# EAGLE design untitled (EAGLE 7.7.0)
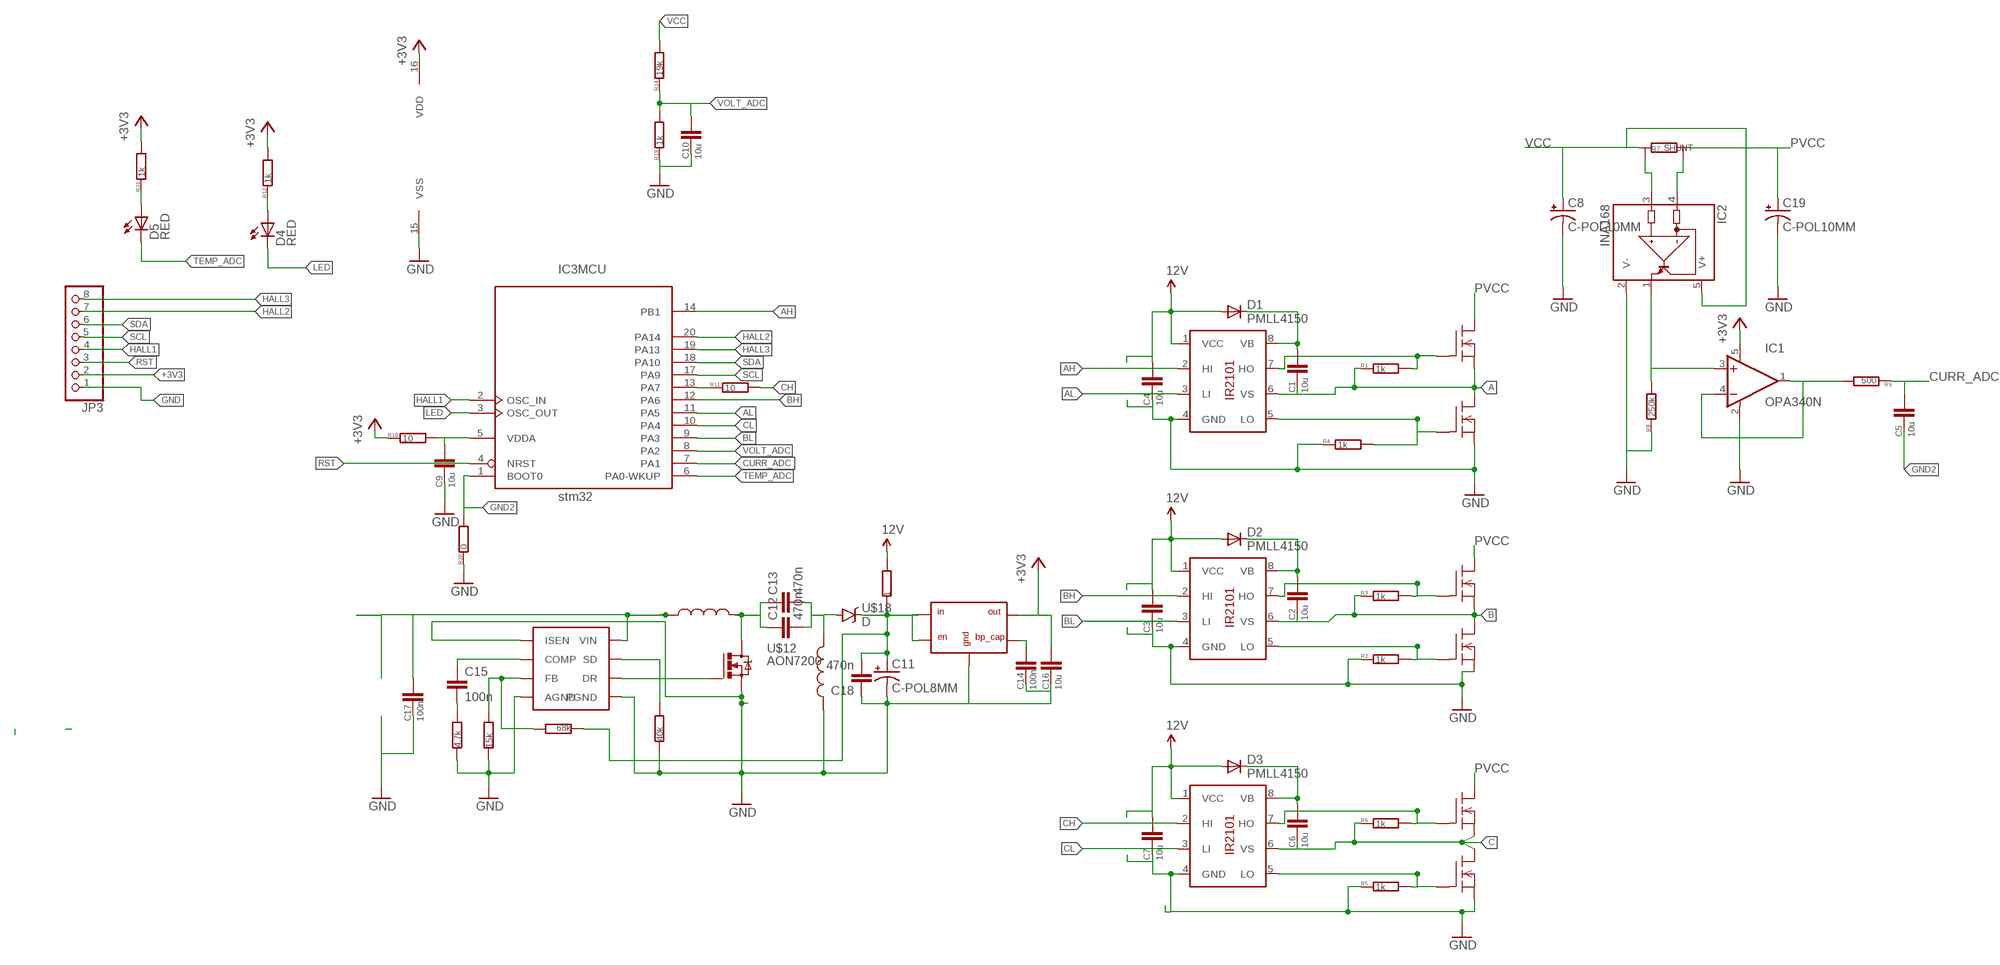
[diagram p0: schematic, sheet 1]

## Parts
C1  10u  CC0805  [C0805]
C2  10u  CC0805  [C0805]
C3  10u  CC0805  [C0805]
C4  10u  CC0805  [C0805]
C5  10u  CC0603  [C0603]
C6  10u  CC0805  [C0805]
C7  10u  CC0805  [C0805]
C8  C-POL10MM  [PCAP10]
C9  10u  CC0805  [C0805]
C10  10u  CC0805  [C0805]
C11  C-POL8MM  [PCAP8]
C12  470n  CC1206  [C1206]
C13  470n  CC1206  [C1206]
C14  100n  CC0805  [C0805]
C15  100n  CC0603  [C0603]
C16  10u  CC0805  [C0805]
C17  100n  CC1206  [C1206]
C18  470n  CC0805  [C0805]
C19  C-POL10MM  [PCAP10]
D1  PMLL4150  [SOD80C]
D2  PMLL4150  [SOD80C]
D3  PMLL4150  [SOD80C]
D4  RED  LED0603  [0603-LED]
D5  RED  LED0603  [0603-LED]
IC1  OPA340N  [SOT23-5]
IC2  INA168  [SOT23-5]
IC3  stm32  STM32F030F4P  [TSSOP20-I]
IC4  LM258DG  [SOT23-5L]
JP3  PINHD-1X8  [1X08]
Q1  DFET  [DIRECT-FET]
Q2  DFET  [DIRECT-FET]
Q3  DFET  [DIRECT-FET]
Q4  DFET  [DIRECT-FET]
Q5  DFET  [DIRECT-FET]
Q6  DFET  [DIRECT-FET]
R1  1k  R0603  [0603]
R2  1k  R0603  [0603]
R3  1k  R0603  [0603]
R4  1k  R0603  [0603]
R5  1k  R0603  [0603]
R6  1k  R0603  [0603]
R7  SHUNT  [SHUNT]
R8  250k  R0603  [0603]
R9  500  R0805  [R0805]
R10  10  R0603  [0603]
R11  10  R0805  [R0805]
R12  1k  R0603  [0603]
R13  1  R0805  [R0805]
R14  19k  R1206  [R1206]
R15  40k  R0603  [0603]
R16  4.7k  R0603  [0603]
R17  15k  R0603  [0603]
R18  68k  R0805  [R0805]
R19  1k  R0805  [R0805]
R20  0  R0805  [R0805]
R21  1k  R0603  [0603]
U$1  IR2101  [SO08]
U$2  IR2101  [SO08]
U$3  IR2101  [SO08]
U$4  INDUCTOR  [8MM_INDURCOR]
U$5  INDUCTOR  [8MM_INDURCOR]
U$8  LM3488  [S-PDSO-G8]
U$12  AON7200  [DFN3X3]
U$18  D  SS14  [SMA-DIODE]

## Nets
12V: C3.1 C4.1 C7.1 D1.A D2.A D3.A R13.2 U$1.1(VCC) U$2.1(VCC) U$3.1(VCC)
12VIN: C11.P$1(+) C18.2 IC4.1(IN) IC4.3(EN) R13.1 R18.1 U$18.C
+3V3: C16.1 IC1.5(V+) IC3.16(PWR:VDD) IC4.5(OUT) JP3.2 R10.1 R12.2 R21.2
A: C1.2 Q1.S Q1.S1(S) Q2.D Q2.D1(D) R1.1 U$1.6(VS)
AH: IC3.14(MCU:PB1) U$1.2(HI)
AL: IC3.11(MCU:PA5) U$1.3(LI)
B: C2.2 Q3.S Q3.S1(S) Q4.D Q4.D1(D) R3.1 U$2.6(VS)
BH: IC3.12(MCU:PA6) U$2.2(HI)
BL: IC3.9(MCU:PA3) U$2.3(LI)
C: C6.2 Q5.S Q5.S1(S) Q6.D Q6.D1(D) R6.1 U$3.6(VS)
CH: R11.2 U$3.2(HI)
CL: IC3.10(MCU:PA4) U$3.3(LI)
CURR_ADC: C5.1 IC3.7(MCU:PA1) R9.1
GND: C3.2 C4.2 C7.2 C8.P$2(-) C9.2 C10.2 C11.P$2(-) C14.2 C16.2 C17.2 C18.1 C19.P$2(-) IC1.2(V-) IC2.2(V-) IC3.15(PWR:VSS) IC4.2(GND) JP3.1 Q2.S Q2.S1(S) Q4.S Q4.S1(S) Q6.S Q6.S1(S) R2.1 R4.1 R5.1 R8.1 R15.1 R16.1 R17.1 R19.1 R20.1 U$1.4(GND) U$2.4(GND) U$3.4(GND) U$4.P$1 U$8.1(ISEN) U$8.4(AGND) U$8.5(PGND) U$12.S:1(S) U$12.S:2(S) U$12.S:3(S)
GND2: C5.2 IC3.1(MCU:BOOT0) R20.2
HALL1: IC3.2(MCU:OSC_IN) JP3.4
HALL2: IC3.20(MCU:PA14) JP3.7
HALL3: IC3.19(MCU:PA13) JP3.8
LED: D4.C IC3.3(MCU:OSC_OUT)
N$1: Q3.GATE(G) R3.2 U$2.7(HO)
N$2: C2.1 D2.C U$2.8(VB)
N$3: Q4.GATE(G) R2.2 U$2.5(LO)
N$4: Q1.GATE(G) R1.2 U$1.7(HO)
N$5: C1.1 D1.C U$1.8(VB)
N$6: Q5.GATE(G) R6.2 U$3.7(HO)
N$7: C6.1 D3.C U$3.8(VB)
N$8: Q2.GATE(G) R4.2 U$1.5(LO)
N$9: Q6.GATE(G) R5.2 U$3.5(LO)
N$10: IC2.3(IN+) R7.P$3
N$11: IC2.4(IN-) R7.P$4
N$13: C14.1 IC4.4(CAP)
N$14: IC3.13(MCU:PA7) R11.1
N$15: IC1.3(+IN) IC2.1(OUT) R8.2
N$16: IC1.1(OUT) IC1.4(-IN) R9.2
N$17: C9.1 IC3.5(MCU:VDDA) R10.2
N$18: D4.A R12.1
N$19: D5.A R21.1
N$25: R15.2 U$8.7(SD)
N$27: U$8.6(DR) U$12.G
N$28: C12.1 C13.1 U$5.P$2 U$12.D U$12.D:1(D) U$12.D:2(D) U$12.D:3(D) U$12.D:4(D) U$12.D:5(D) U$12.D:6(D)
N$29: C12.2 C13.2 U$4.P$2 U$18.A
N$30: C15.1 U$8.2(COMP)
N$31: C15.2 R16.2
N$32: R17.2 R18.2 U$8.3(FB)
PVCC: C19.P$1(+) Q1.D Q1.D1(D) Q3.D Q3.D1(D) Q5.D Q5.D1(D) R7.P$2
RST: IC3.4(MCU:NRST) JP3.3
SCL: IC3.17(MCU:PA9) JP3.5
SDA: IC3.18(MCU:PA10) JP3.6
TEMP_ADC: D5.C IC3.6(MCU:PA0-WKUP)
VCC: C8.P$1(+) C17.1 IC2.5(V+) R7.P$1 R14.2 U$5.P$1 U$8.8(VIN)
VOLT_ADC: C10.1 IC3.8(MCU:PA2) R14.1 R19.2

## Library data of the parts
C1-C7 C9 C10 C14 C16 C17 = smalsmd:C: Capacitor
C8 C11 C19 = CasaLibrary:C-POL
C12 C13 C15 C18 = CasaLibrary:C: Capacitor
D1-D3 = DIODE:PMLL4150: DIODE high speed
D4 D5 = CasaLibrary:LED
IC1 = burr-brown:OPA340: Rail-to-Rail Operational Amplifiers Single-Supply, MicroAmplifier(TM) Series; MPN: OPA340NA/3KG4; OC_FARNELL: 1234805; OC_NEWARK: 13M5177
IC2 = burr-brown:INA168: High-Side Measurement Current Shunt Monitor; MF: TEXAS INSTRUMENTS; MPN: INA168NA/250; OC_FARNELL: 4375737; OC_NEWARK: 35C1744
IC3 = stm32:STM32F030F*P: ARM 32-bit Cortex™-M0 CPU 48 MHz maximum frequency 16 Kbytes of Flash memory 4 kbytes of SRAM 15 GPIOs 2.4 to 3.6 V application supply
IC4 = CasaLibrary:LM258DG
JP3 = pinhead:PINHD-1X8: PIN HEADER
Q1-Q6 = CasaLibrary:DFET
R1-R6 R8-R12 R14 R19-R21 = smalsmd:R
R7 = CasaLibrary:SHUNT
R13 R15-R18 = CasaLibrary:R
U$1-U$3 = gateDriver:IR2101
U$4 U$5 = CasaLibrary:INDUCTOR
U$8 = CasaLibrary:LM3488
U$12 = CasaLibrary:AON7200
U$18 = CasaLibrary:SS14

## Board
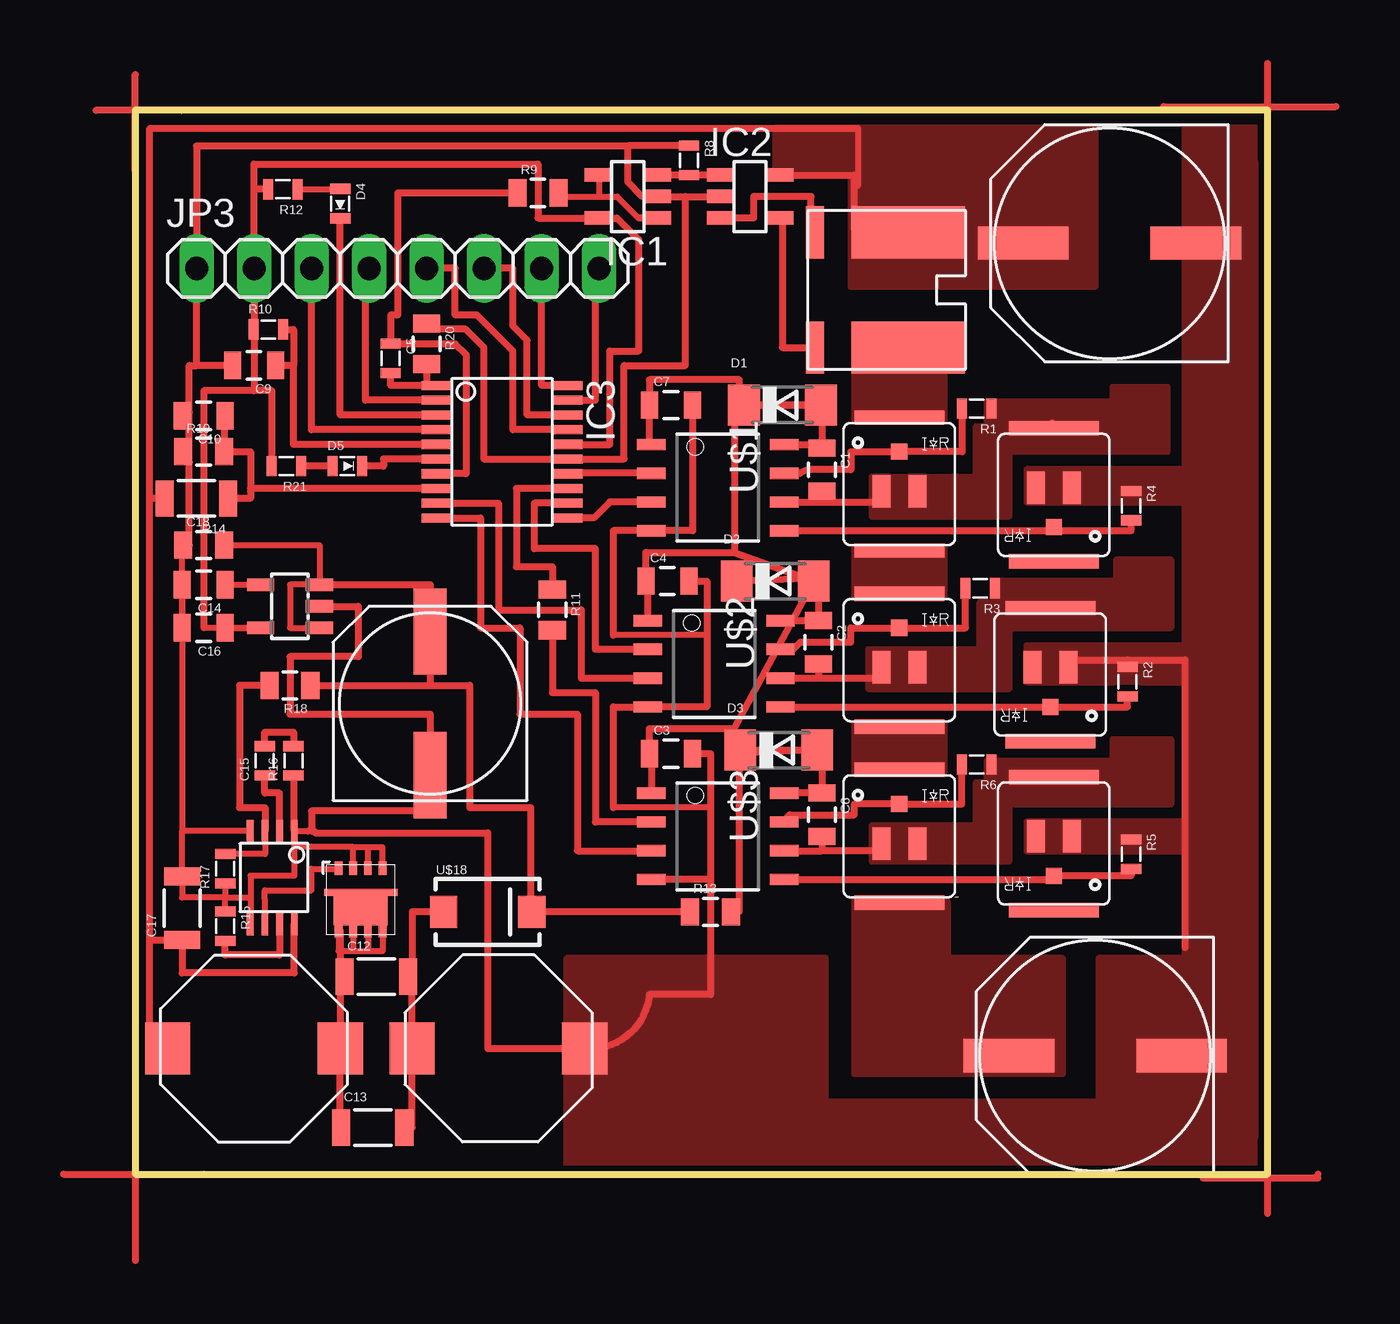
[diagram p1: board, top side]

Size 50 x 47 mm. Coordinates in mm from the lower left corner, seen from the top.
Outline: 36.35,12.22 36.2,12.22
Outline: 0,0 50,0 50,47 0,47 0,0
Copper layers (1*16): Top 0.035mm / dielectric 1.5mm / Bottom 0.035mm
Design rules "new *": minimum track width 0.25mm, minimum drill 0.3mm, track to track 0.3mm, track to pad 0.3mm, pad to pad 0.3mm, via to via 0.3mm, smd to smd 0.3mm, copper to edge 0.25mm, drill to drill 0.25mm, minimum pad ring 10mil, minimum via ring 8mil, stop-mask expansion 0mil, vias tented up to drill 0mil, thermal gap 10mil

### Footprints (pad centres in the part's own frame; a part is rotated, then mirrored left to right if it is on the bottom)
C0805 = smd 0.75 x 1.2: 1 -0.953,0; 2 0.953,0
C0603 = smd 0.45 x 0.9: 1 -0.65,0; 2 0.65,0
PCAP10 = smd 4 x 1.46: P$1 -3.81,0; P$2 3.81,0
PCAP8 = smd 3.8 x 1.46: P$1 -3.175,0; P$2 3.175,0
C1206 = smd 0.8 x 1.6: 1 -1.4,0; 2 1.4,0
C0805' = smd 0.8 x 1.2: 1 -0.9,0; 2 0.9,0
SOD80C = smd 1.4 x 1.8: A 1.7,0; C -1.7,0
0603-LED = smd 0.45 x 0.9: A -0.65,0; C 0.65,0
SOT23-5 = smd 0.6 x 1.2: 1 -0.95,-1.306; 2 0,-1.306; 3 0.95,-1.306; 4 0.95,1.306; 5 -0.95,1.306
TSSOP20-I = smd 0.4 x 1.35: 1 -2.925,-2.875; 2 -2.275,-2.875; 3 -1.625,-2.875; 4 -0.975,-2.875; 5 -0.325,-2.875; 6 0.325,-2.875; 7 0.975,-2.875; 8 1.625,-2.875; 9 2.275,-2.875; 10 2.925,-2.875; 11 2.925,2.875; 12 2.275,2.875; 13 1.625,2.875; 14 0.975,2.875; 15 0.325,2.875; 16 -0.325,2.875; 17 -0.975,2.875; 18 -1.625,2.875; 19 -2.275,2.875; 20 -2.925,2.875
SOT23-5L = smd 0.55 x 1.2: 1 -0.95,-1.3; 2 0,-1.3; 3 0.95,-1.3; 4 0.95,1.3; 5 -0.95,1.3
1X08 = drill 1.016 long: 1 -8.89,0; 2 -6.35,0; 3 -3.81,0; 4 -1.27,0; 5 1.27,0; 6 3.81,0; 7 6.35,0; 8 8.89,0
DIRECT-FET = smd 3.969 x 0.635: D 0.079,3.096; D1 0.079,-2.778 | smd 0.714 x 0.714: GATE 0.079,1.587 | smd 0.794 x 1.429: S -0.714,-0.159; S1 0.873,-0.159
0603 = smd 0.45 x 0.9: 1 -0.65,0; 2 0.65,0
SHUNT = smd 2.3 x 5: P$1 6.032,2.54; P$2 0.953,2.54 | smd 2.3 x 0.8: P$3 6.032,6.668; P$4 0.953,6.668
R0805 = smd 0.8 x 1.2: 1 -0.9,0; 2 0.9,0
R1206 = smd 0.8 x 1.6: 1 -1.4,0; 2 1.4,0
SO08 = smd 0.5 x 1.25: 1 -1.905,-2.934; 2 -0.635,-2.934; 3 0.635,-2.934; 4 1.905,-2.934; 5 1.905,2.934; 6 0.635,2.934; 7 -0.635,2.934; 8 -1.905,2.934
8MM_INDURCOR = smd 2.31 x 2: P$1 -0.159,3.81; P$2 -0.159,-3.81
S-PDSO-G8 = smd 1 x 0.305: 1 -0.55,-0.6; 2 -0.55,-1.25; 3 -0.55,-1.9; 4 -0.55,-2.55; 5 3.55,-2.55; 6 3.55,-1.9; 7 3.55,-1.25; 8 3.55,-0.6
DFN3X3 = smd 1.6 x 2.375: D -0.425,0.05 | smd 0.3 x 0.8: D:1 0.225,1.275; D:2 0.225,-1.175 | smd 0.6 x 0.35: D:3 -1.461,-0.916; D:4 -1.461,-0.266; D:5 -1.461,0.384; D:6 -1.461,1.034; G 1.289,1.034; S:1 1.289,0.384; S:2 1.289,-0.266; S:3 1.289,-0.916
SMA-DIODE = smd 1.2 x 1.4: A -1.95,0; C 1.95,0

### Placement (x,y rotation side)
C1  30.32,31.11 270 top
C2  30.16,23.5 270 top
C3  23.65,18.57 0 top
C4  23.5,26.19 0 top
C5  11.27,36.04 270 top
C6  30.32,15.88 270 top
C7  23.65,33.97 0 top
C8  43.02,41.12 0 top
C9  5.24,35.72 180 top
C10  3.02,33.5 180 top
C11  13.02,20.8 270 top
C12  10.64,8.73 0 top
C13  10.48,2.06 0 top
C14  3.02,26.04 180 top
C15  5.71,18.26 90 top
C16  3.02,24.13 180 top
C17  2.06,11.75 90 top
C18  470n  [C0805']  3.02,27.78 0 top
C19  42.39,5.24 0 top
D1  28.57,33.97 0 top
D2  28.26,26.19 0 top
D3  28.42,18.73 0 top
D4  9.05,42.86 270 top
D5  9.37,31.27 0 top
IC1  21.75,43.18 90 top
IC2  27.15,43.18 270 top
IC3  16.19,31.91 270 top
IC4  6.83,25.08 90 top
JP3  11.59,40.01 0 top
Q1  33.66,30.32 0 top
Q2  40.64,30.16 180 top
Q3  33.66,22.54 0 top
Q4  40.48,22.23 180 top
Q5  33.66,14.76 0 top
Q6  40.64,14.76 180 top
R1  37.15,33.81 180 top
R2  43.81,21.75 270 top
R3  37.31,25.88 180 top
R4  43.97,29.53 270 top
R5  43.97,14.13 270 top
R6  37.15,18.1 180 top
R7  36.67,35.56 90 top
R8  24.45,44.77 270 top
R9  17.78,43.34 0 top
R10  5.87,37.31 0 top
R11  18.41,24.92 270 top
R12  6.51,43.5 180 top
R13  25.4,11.59 0 top
R14  2.7,29.84 180 top
R15  3.97,10.95 270 top
R16  6.99,18.26 90 top
R17  3.97,13.49 90 top
R18  6.83,21.59 180 top
R19  3.02,31.91 0 top
R20  12.86,36.67 270 top
R21  6.67,31.27 180 top
U$1  25.72,30.32 270 top
U$2  25.56,22.54 270 top
U$3  25.72,14.92 270 top
U$4  16.03,5.4 270 top
U$5  5.24,5.71 90 top
U$8  7.62,14.61 270 top
U$12  10,12.22 90 top
U$18  15.56,11.59 0 top

### Tracks (layer width: path | path; a pad name or v marks a point on that pad's centre or on a via)
12V
  Top 0.254: 26.67,18.73 D3.A
  Top 0.305: D3.A 26.46,18.57 26.46,19.68 | 26.46,19.68 D2.A 26.46,27.46 | 26.46,27.46 26.46,33.97 D1.A 26.67,33.97 26.67,35.08 22.7,35.08 C7.1 22.7,32.23 U$1.1 | 26.46,27.46 22.54,27.46 C4.1 22.62,26.19 U$2.1 | 26.46,19.68 22.7,19.68 C3.1 22.78,18.57 U$3.1 | R13.2 26.67,11.59 26.67,18.73
12VIN
  Top 0.254: C18.2 8.13,27.78 IC4.3 6.83,26.03 6.83,24.13 IC4.1
  Top 0.305: R13.1 U$18.C 17.46,11.59 17.46,16.19 14.76,16.19 14.76,21.59 13.02,21.59 | IC4.3 13.02,26.04 C11.P$1 13.02,21.59 | R18.1 13.02,21.59
+3V3
  Top 0.254: C16.1 IC4.5 3.02,24.13
  Top 0.305: IC3.16 20.95,32.23 20.95,36.35 22.23,36.35 22.23,41.27 21.27,42.23 IC1.5 17.78,42.23 17.78,44.61 5.24,44.61 5.24,43.5 | 5.24,43.5 JP3.2 5.24,37.47 | R12.2 5.24,43.5 | 5.24,37.47 5.24,34.61 | 5.24,34.61 3.02,34.61 3.02,24.13 | R10.1 5.24,37.47 | R21.2 6.03,31.27 6.03,34.61 5.24,34.61
A
  Top 0.305: 40.48,33.18 40.48,32.86 | U$1.6 30.16,29.69 | 30.16,29.69 32.94,29.69 Q1.S | C1.2 30.16,29.69
  pour Top (no thermals): 32.54,30.8 37.15,30.8 37.15,33.02 37.62,33.02 37.62,34.13 43.18,34.13 43.18,34.77 45.56,34.77 45.56,31.91 38.58,31.91 38.58,29.05 32.54,29.05
AH
  Top 0.305: U$1.2 19.07,30.96 IC3.14
AL
  Top 0.305: IC3.11 20.25,28.98 20.95,29.69 U$1.3
B
  Top 0.305: U$2.6 30.16,21.91 | C2.2 30.16,21.91 | Q3.S 32.86,22.23 32.86,21.91 30.16,21.91
  pour Top (no thermals): 32.38,23.18 37.31,23.18 37.31,25.24 37.94,25.24 37.94,26.19 43.34,26.19 43.34,27.15 45.72,27.15 45.72,24.13 38.58,24.13 38.58,21.43 32.38,21.43
BH
  Top 0.305: U$2.2 20.32,23.18 20.32,27.62 17.62,27.62 17.62,29.63 IC3.12
BL
  Top 0.305: IC3.9 16.03,29.63 16.03,24.92 19.68,24.92 19.68,21.91 U$2.3
C
  Top 0.305: U$3.6 30.32,14.29 | 32.94,14.43 Q5.S 32.86,14.61 32.86,14.29 30.32,14.29 | C6.2 30.32,14.29 | 40.48,17.62 40.48,17.46
  pour Top (no thermals): 32.54,15.4 37.15,15.4 37.15,17.3 37.62,17.3 37.62,18.26 43.18,18.26 43.18,19.21 45.72,19.21 45.72,16.35 38.58,16.35 38.58,13.81 32.54,13.81
CH
  Top 0.305: R11.2 18.41,21.27 20.32,21.27 20.32,15.56 U$3.2
CL
  Top 0.305: IC3.10 15.24,28.98 15.24,24.13 16.99,24.13 16.99,20.32 19.53,20.32 19.53,14.29 U$3.3
CURR_ADC
  Top 0.305: R9.1 11.59,43.34 11.59,37.94 11.27,37.94 C5.1 11.29,36.67 14.13,36.67 14.61,36.2 14.61,30.96 14.58,30.93 IC3.7
GND
  Top 0.254: 25.24,23.81 21.11,23.81 | 25.4,16.19 21.11,16.19 | U$8.4 2.06,15.15 | U$12.S:3 10.92,14.45 10.27,14.45 | U$12.S:1 9.62,14.45 | 9.62,14.45 10.27,14.45 | U$12.S:2 10.27,14.45 | R15.1 3.97,12.22 | 3.97,12.22 5.08,12.22 | 5.08,12.22 U$8.5 | R17.1 3.97,12.22 | 3.97,12.22 2.06,12.22 C17.2 2.06,15.15 | 7.02,14.45 U$8.1 7.62,15.15 7.94,15.15 7.94,15.08 | 7.02,14.45 7.02,13.18 5.08,13.18 5.08,12.22 | C14.2 2.06,27.78 C18.1 | C16.2 C14.2 | C14.2 2.06,15.15 | 9.62,14.45 7.02,14.45
  Top 0.305: 41.51,22.72 43.81,22.72 | 43.81,22.72 R2.1 | 25.4,13.02 25.4,16.19 25.4,18.57 C3.2 | 24.29,43.18 IC1.2 22.38,43.18 21.75,43.81 21.75,45.4 | 24.29,43.18 IC2.2 | 43.81,22.72 46.35,22.72 46.35,10 | C4.2 25.24,26.19 25.24,23.81 25.24,20.64 U$2.4 21.11,20.64 21.11,16.19 | 21.11,23.81 21.11,28.42 U$1.4 24.61,28.42 C7.2 | 25.4,13.02 25.4,7.94 22.7,7.94 arc-90 U$4.P$1 15.56,5.56 15.56,15.08 7.94,15.08 | 25.4,13.02 U$3.4 | IC4.2 9.84,25.08 9.84,22.86 6.83,22.86 6.83,20.32 13.02,20.32 C11.P$2 13.02,16.03 7.78,16.03 7.78,15.15 7.62,15.15 | 21.75,45.4 2.7,45.4 JP3.1 2.7,35.72 | 2.06,27.78 2.38,27.78 2.38,31.43 | 2.38,31.43 2.38,33.66 | 2.38,33.66 2.38,35.72 2.7,35.72 | C9.2 2.7,35.72 | R19.1 2.38,31.43 | R20.1 12.86,37.32 14.59,37.32 15.4,36.51 15.4,31.59 19.06,31.59 IC3.15 21.59,31.58 21.59,35.72 24.29,35.72 24.29,43.18 | C10.2 2.38,33.66 | R8.1 21.75,45.42 21.75,45.4 | U$8.1 7.02,17.61 R16.1
  pour Top (no thermals): 46.35,46.2 46.35,31.11 39.37,31.11 39.37,29.69 46.35,29.69 46.35,23.34 39.37,23.34 39.37,21.75 46.35,21.75 46.35,15.56 39.37,15.56 39.37,14.29 46.35,14.29 46.35,9.53 42.55,9.53 42.55,3.17 30.48,3.17 30.48,9.53 19.05,9.53 19.05,0.32 49.85,0.32 49.85,46.2
GND2
  Top 0.305: IC3.1 12.86,34.83 | 12.86,34.83 11.27,34.83 C5.2 | R20.2 12.86,34.83
HALL1
  Top 0.305: IC3.2 10.16,34.18 10.16,39.69 JP3.4
HALL2
  Top 0.305: IC3.20 17.94,34.83 JP3.7
HALL3
  Top 0.305: IC3.19 20.32,34.18 20.32,40.01 JP3.8
LED
  Top 0.305: IC3.3 9.05,33.53 D4.C
N$1
  Top 0.305: R3.2 36.66,24.13 Q3.GATE 31.59,24.13 31.59,23.5 29.37,23.5 29.05,23.18 U$2.7
N$2
  Top 0.305: D2.C 30.16,26.35 C2.1 U$2.8
N$3
  Top 0.305: U$2.5 Q4.GATE | 40.56,20.64 Q4.GATE | Q4.GATE 43.81,20.64 R2.2
N$4
  Top 0.305: R1.2 36.51,33.81 36.51,31.91 Q1.GATE 31.59,31.91 31.59,31.11 29.69,31.11 29.37,30.96 U$1.7
N$5
  Top 0.305: D1.C 30.32,33.97 C1.1 arc90 30,32.23 U$1.8
N$6
  Top 0.305: R6.2 36.5,16.35 Q5.GATE 31.75,16.35 31.75,15.88 28.89,15.88 28.57,15.56 U$3.7
N$7
  Top 0.305: U$3.8 C6.1 30.32,18.73 D3.C
N$8
  Top 0.305: U$1.5 40.48,28.42 | Q2.GATE 40.48,28.57 40.48,28.42 | 40.48,28.42 43.97,28.42 R4.2
N$9
  Top 0.305: R5.2 43.97,13.18 Q6.GATE 40.56,13.02 U$3.5
N$10
  Top 0.305: R7.P$3 29.84,41.43 29.84,43.18 27.3,43.18 27.3,42.23 26,42.23 IC2.3
N$11
  Top 0.305: IC2.4 28.57,42.23 28.57,36.51 R7.P$4
N$12
  Top 0.305: 0,3.81 0,-3.81
N$13
  Top 0.254: C14.1 IC4.4
N$14
  Top 0.305: IC3.13 16.83,30.28 16.83,26.83 18.41,26.83 R11.1
N$15
  Top 0.305: IC2.1 26.04,44.13 24.45,44.13 | 24.45,44.13 23.02,44.13 IC1.3 | R8.2 24.45,44.13
N$16
  Top 0.254: 22.22,42.23 21.27,43.18 20.48,43.18 | R9.2 18.89,43.34 19.05,43.18 20.48,43.18 | IC1.4 20.48,44.09 20.48,43.18
  Top 0.305: IC1.1 22.22,42.23
N$17
  Top 0.305: IC3.5 6.99,32.23 6.99,35.72 | 6.99,35.72 C9.1 | R10.2 6.99,37.31 6.99,35.72
N$18
  Top 0.254: R12.1 D4.A
N$19
  Top 0.305: D5.A R21.1
N$20
  Top 0.305: -3.17,0 3.02,0
N$21
  Top 0.305: 45.4,47.15 53.02,47.15
N$22
  Top 0.305: 50.01,44.93 50.01,49.05
N$23
  Top 0.305: 47.15,-0.16 52.23,-0.16 52.23,0
N$24
  Top 0.305: 50.01,-1.75 50.01,1.43
N$25
  Top 0.254: U$8.7
  Top 0.305: U$8.7 6.37,9.68 3.97,9.68 R15.2
N$26
  Top 0.305: 0,44.29 0,48.58
N$27
  Top 0.254: U$8.6 5.72,12.14 5.71,12.14 5.71,12.54 7.78,12.54 7.78,13.49 8.97,13.49 U$12.G
N$28
  Top 0.254: U$12.D:1 9.3,12.45 arc-90 U$12.D | U$12.D:2 10.6,12.45 arc90 U$12.D | U$12.D arc-90 10.27,11.48 U$12.D:4 10.27,9.84 | C12.1 9.05,8.57 | C13.1 9.05,2.38 | U$12.D:3 10.92,9.84 10.27,9.84 | 10.27,9.84 9.62,9.84 | 9.62,9.84 8.97,9.84 U$12.D:6 9.05,10.76 | U$12.D:5 9.62,9.84
  Top 0.305: 9.05,2.38 U$5.P$2 9.05,8.57 9.05,10.76
N$29
  Top 0.254: C12.2 11.91,8.57 | C13.2 12.22,2.06
  Top 0.305: 12.22,2.06 U$4.P$2 12.22,8.73 | U$18.A 12.22,11.59 12.22,8.73 | 12.22,8.73 C12.2
N$30
  Top 0.254: 6.35,15.15 U$8.2
  Top 0.305: U$8.2 6.37,16.83 5.71,16.83 C15.1
N$31
  Top 0.305: C15.2 5.71,19.53 6.99,19.53 R16.2
N$32
  Top 0.254: U$8.3 5.72,14.14 R17.2
  Top 0.305: R18.2 4.6,21.59 4.6,16.19 5.72,16.19 U$8.3
N$33
  Top 0.305: 2.06,46.99 -1.75,46.99
PVCC
  pour Top (no thermals): 31.75,35.88 31.75,33.34 35.72,33.34 35.72,35.88
  pour Top (no thermals): 31.75,27.62 31.75,25.56 35.72,25.56 35.72,27.62
  pour Top (no thermals): 31.75,19.84 31.75,17.78 35.72,17.78 35.72,19.84
  pour Top (no thermals): 31.75,12.06 31.75,4.45 40.96,4.45 40.96,9.53 35.88,9.53 35.88,12.06
RST
  Top 0.305: IC3.4 7.78,32.88 JP3.3
SCL
  Top 0.305: IC3.17 16.67,32.88 16.67,36.35 15.08,37.94 14.13,37.94 14.13,40.01 JP3.5
SDA
  Top 0.305: IC3.18 17.3,33.53 17.3,36.83 16.67,37.47 16.67,40.01 JP3.6
TEMP_ADC
  Top 0.305: IC3.6 10.95,31.58 10.95,31.27 D5.C
VCC
  Top 0.254: U$5.P$1 1.11,5.71 0.64,5.71 | 31.91,46.2 31.91,43.66 | C17.1 2.06,10.32
  Top 0.305: R7.P$1 31.75,41.75 31.75,44.13 28.73,44.13 IC2.5 | 0.64,5.71 0.64,10.32 | 0.64,10.32 0.64,29.84 | 0.64,29.84 0.64,46.2 31.91,46.2 | 0.64,10.32 2.06,10.32 2.06,8.89 7.02,8.89 U$8.8 | R14.2 0.64,29.84
  pour Top (no thermals): 42.39,46.2 28.26,46.2 28.26,44.13 31.59,44.13 31.59,39.21 42.39,39.21
VOLT_ADC
  Top 0.305: 5.08,30.28 5.08,31.91 R19.2 3.92,33.66 C10.1 | R14.1 5.08,29.84 5.08,30.16 5.08,30.28 | IC3.8 5.08,30.28

### Text on the board
_tNames: R8 | IC2 | R9 | IC1 | R10 | C5 | R20 | D1 | C9 | IC3 | C7 | R19 | C10 | U$1 | R1 | D5 | C1 | R21 | R4 | C18 | R14 | D2 | C4 | R11 | U$2 | C14 | R3 | C2 | C16 | R2 | R18 | D3 | C3 | U$3 | C15 | R16 | C6 | R6 | R5 | R17 | U$18 | R15 | R13 | C17 | C12 | C13